# Altium schematic sheet 0021_Processor PD BOM -.SchDoc
size A3
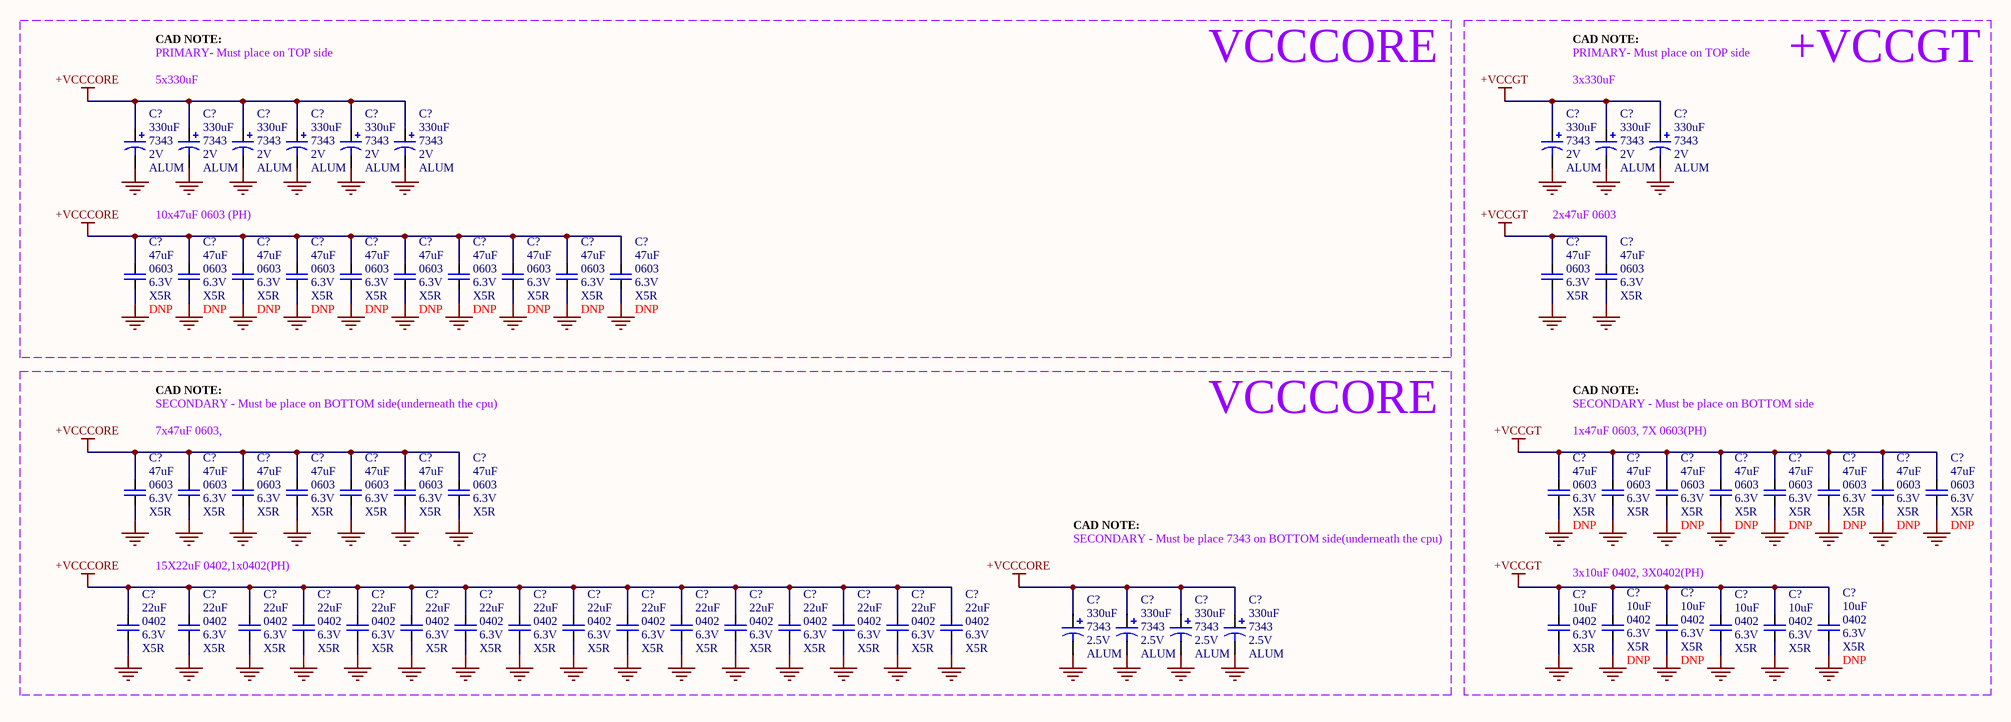
[diagram p0: 0021_Processor PD BOM -.SchDoc]

## Parts
(Parts that share a designator on the sheet are numbered #1, #2 ... from top to bottom, then left to right.)
C?#1  value 330uF  Case/Package: 7343  Voltage: 2V  Dielectric: ALUM  [CAPC_CASE-D2_7343_1.5]  (hidden comment: cap_polar)
C?#2  value 330uF  Case/Package: 7343  Voltage: 2V  Dielectric: ALUM  [CAPC_CASE-D2_7343_1.5]  (hidden comment: cap_polar)
C?#3  value 330uF  Case/Package: 7343  Voltage: 2V  Dielectric: ALUM  [CAPC_CASE-D2_7343_1.5]  (hidden comment: cap_polar)
C?#4  value 330uF  Case/Package: 7343  Voltage: 2V  Dielectric: ALUM  [CAPC_CASE-D2_7343_1.5]  (hidden comment: cap_polar)
C?#5  value 330uF  Case/Package: 7343  Voltage: 2V  Dielectric: ALUM  [CAPC_CASE-D2_7343_1.5]  (hidden comment: cap_polar)
C?#6  value 330uF  Case/Package: 7343  Voltage: 2V  Dielectric: ALUM  [CAPC_CASE-D2_7343_1.5]  (hidden comment: cap_polar)
C?#7  value 330uF  Case/Package: 7343  Voltage: 2V  Dielectric: ALUM  [CAPC_CASE-D2_7343_1.5]  (hidden comment: cap_polar)
C?#8  value 330uF  Case/Package: 7343  Voltage: 2V  Dielectric: ALUM  [CAPC_CASE-D2_7343_1.5]  (hidden comment: cap_polar)
C?#9  value 330uF  Case/Package: 7343  Voltage: 2V  Dielectric: ALUM  [CAPC_CASE-D2_7343_1.5]  (hidden comment: cap_polar)
C?#10  value 47uF  Case/Package: 0603  Voltage: 6.3V  Dielectric: X5R  [capc0603]
C?#11  value 47uF  Case/Package: 0603  Voltage: 6.3V  Dielectric: X5R  [capc0603]
C?#12  value 47uF  Case/Package: 0603  Voltage: 6.3V  Dielectric: X5R  [capc0603]
C?#13  value 47uF  Case/Package: 0603  Voltage: 6.3V  Dielectric: X5R  [capc0603]
C?#14  value 47uF  Case/Package: 0603  Voltage: 6.3V  Dielectric: X5R  [capc0603]
C?#15  value 47uF  Case/Package: 0603  Voltage: 6.3V  Dielectric: X5R  [capc0603]
C?#16  value 47uF  Case/Package: 0603  Voltage: 6.3V  Dielectric: X5R  [capc0603]
C?#17  value 47uF  Case/Package: 0603  Voltage: 6.3V  Dielectric: X5R  [capc0603]
C?#18  value 47uF  Case/Package: 0603  Voltage: 6.3V  Dielectric: X5R  [capc0603]
C?#19  value 47uF  Case/Package: 0603  Voltage: 6.3V  Dielectric: X5R  [capc0603]
C?#20  value 47uF  Case/Package: 0603  Voltage: 6.3V  Dielectric: X5R  [capc0603]
C?#21  value 47uF  Case/Package: 0603  Voltage: 6.3V  Dielectric: X5R  [capc0603]
C?#22  value 47uF  Case/Package: 0603  Voltage: 6.3V  Dielectric: X5R  [capc0603]
C?#23  value 47uF  Case/Package: 0603  Voltage: 6.3V  Dielectric: X5R  [capc0603]
C?#24  value 47uF  Case/Package: 0603  Voltage: 6.3V  Dielectric: X5R  [capc0603]
C?#25  value 47uF  Case/Package: 0603  Voltage: 6.3V  Dielectric: X5R  [capc0603]
C?#26  value 47uF  Case/Package: 0603  Voltage: 6.3V  Dielectric: X5R  [capc0603]
C?#27  value 47uF  Case/Package: 0603  Voltage: 6.3V  Dielectric: X5R  [capc0603]
C?#28  value 47uF  Case/Package: 0603  Voltage: 6.3V  Dielectric: X5R  [capc0603]
C?#29  value 47uF  Case/Package: 0603  Voltage: 6.3V  Dielectric: X5R  [capc0603]
C?#30  value 47uF  Case/Package: 0603  Voltage: 6.3V  Dielectric: X5R  [capc0603]
C?#31  value 47uF  Case/Package: 0603  Voltage: 6.3V  Dielectric: X5R  [capc0603]
C?#32  value 47uF  Case/Package: 0603  Voltage: 6.3V  Dielectric: X5R  [capc0603]
C?#33  value 47uF  Case/Package: 0603  Voltage: 6.3V  Dielectric: X5R  [capc0603]
C?#34  value 47uF  Case/Package: 0603  Voltage: 6.3V  Dielectric: X5R  [capc0603]
C?#35  value 47uF  Case/Package: 0603  Voltage: 6.3V  Dielectric: X5R  [capc0603]
C?#36  value 47uF  Case/Package: 0603  Voltage: 6.3V  Dielectric: X5R  [capc0603]
C?#37  value 330uF  Case/Package: 7343  Voltage: 2.5V  Dielectric: ALUM  [CAPC_CASE-D2_7343_1.5]  (hidden comment: cap_polar)
C?#38  value 330uF  Case/Package: 7343  Voltage: 2.5V  Dielectric: ALUM  [CAPC_CASE-D2_7343_1.5]  (hidden comment: cap_polar)
C?#39  value 330uF  Case/Package: 7343  Voltage: 2.5V  Dielectric: ALUM  [CAPC_CASE-D2_7343_1.5]  (hidden comment: cap_polar)
C?#40  value 330uF  Case/Package: 7343  Voltage: 2.5V  Dielectric: ALUM  [CAPC_CASE-D2_7343_1.5]  (hidden comment: cap_polar)
C?#41  value 22uF  Case/Package: 0402  Voltage: 6.3V  Dielectric: X5R  [CAPC0402]
C?#42  value 22uF  Case/Package: 0402  Voltage: 6.3V  Dielectric: X5R  [CAPC0402]
C?#43  value 22uF  Case/Package: 0402  Voltage: 6.3V  Dielectric: X5R  [CAPC0402]
C?#44  value 22uF  Case/Package: 0402  Voltage: 6.3V  Dielectric: X5R  [CAPC0402]
C?#45  value 22uF  Case/Package: 0402  Voltage: 6.3V  Dielectric: X5R  [CAPC0402]
C?#46  value 22uF  Case/Package: 0402  Voltage: 6.3V  Dielectric: X5R  [CAPC0402]
C?#47  value 22uF  Case/Package: 0402  Voltage: 6.3V  Dielectric: X5R  [CAPC0402]
C?#48  value 22uF  Case/Package: 0402  Voltage: 6.3V  Dielectric: X5R  [CAPC0402]
C?#49  value 22uF  Case/Package: 0402  Voltage: 6.3V  Dielectric: X5R  [CAPC0402]
C?#50  value 22uF  Case/Package: 0402  Voltage: 6.3V  Dielectric: X5R  [CAPC0402]
C?#51  value 22uF  Case/Package: 0402  Voltage: 6.3V  Dielectric: X5R  [CAPC0402]
C?#52  value 22uF  Case/Package: 0402  Voltage: 6.3V  Dielectric: X5R  [CAPC0402]
C?#53  value 22uF  Case/Package: 0402  Voltage: 6.3V  Dielectric: X5R  [CAPC0402]
C?#54  value 22uF  Case/Package: 0402  Voltage: 6.3V  Dielectric: X5R  [CAPC0402]
C?#55  value 22uF  Case/Package: 0402  Voltage: 6.3V  Dielectric: X5R  [CAPC0402]
C?#56  value 22uF  Case/Package: 0402  Voltage: 6.3V  Dielectric: X5R  [CAPC0402]
C?#57  value 10uF  Case/Package: 0402  Voltage: 6.3V  Dielectric: X5R  [CAPC0402]
C?#58  value 10uF  Case/Package: 0402  Voltage: 6.3V  Dielectric: X5R  [CAPC0402]
C?#59  value 10uF  Case/Package: 0402  Voltage: 6.3V  Dielectric: X5R  [CAPC0402]
C?#60  value 10uF  Case/Package: 0402  Voltage: 6.3V  Dielectric: X5R  [CAPC0402]
C?#61  value 10uF  Case/Package: 0402  Voltage: 6.3V  Dielectric: X5R  [CAPC0402]
C?#62  value 10uF  Case/Package: 0402  Voltage: 6.3V  Dielectric: X5R  [CAPC0402]

## Nets
+VCCCORE: C?#1.1(+) C?#2.1(+) C?#3.1(+) C?#4.1(+) C?#5.1(+) C?#6.1(+) C?#10.1 C?#11.1 C?#12.1 C?#13.1 C?#14.1 C?#15.1 C?#16.1 C?#17.1 C?#18.1 C?#19.1 C?#22.1 C?#23.1 C?#24.1 C?#25.1 C?#26.1 C?#27.1 C?#28.1 C?#37.1(+) C?#38.1(+) C?#39.1(+) C?#40.1(+) C?#41.1 C?#42.1 C?#43.1 C?#44.1 C?#45.1 C?#46.1 C?#47.1 C?#48.1 C?#49.1 C?#50.1 C?#51.1 C?#52.1 C?#53.1 C?#54.1 C?#55.1 C?#56.1
+VCCGT: C?#7.1(+) C?#8.1(+) C?#9.1(+) C?#20.1 C?#21.1 C?#29.1 C?#30.1 C?#31.1 C?#32.1 C?#33.1 C?#34.1 C?#35.1 C?#36.1 C?#57.1 C?#58.1 C?#59.1 C?#60.1 C?#61.1 C?#62.1
GND: C?#1.2 C?#2.2 C?#3.2 C?#4.2 C?#5.2 C?#6.2 C?#7.2 C?#8.2 C?#9.2 C?#10.2 C?#11.2 C?#12.2 C?#13.2 C?#14.2 C?#15.2 C?#16.2 C?#17.2 C?#18.2 C?#19.2 C?#20.2 C?#21.2 C?#22.2 C?#23.2 C?#24.2 C?#25.2 C?#26.2 C?#27.2 C?#28.2 C?#29.2 C?#30.2 C?#31.2 C?#32.2 C?#33.2 C?#34.2 C?#35.2 C?#36.2 C?#37.2 C?#38.2 C?#39.2 C?#40.2 C?#41.2 C?#42.2 C?#43.2 C?#44.2 C?#45.2 C?#46.2 C?#47.2 C?#48.2 C?#49.2 C?#50.2 C?#51.2 C?#52.2 C?#53.2 C?#54.2 C?#55.2 C?#56.2 C?#57.2 C?#58.2 C?#59.2 C?#60.2 C?#61.2 C?#62.2

## Notes on the sheet
- CAD NOTE:
- PRIMARY- Must place on TOP side
- 5x330uF
- VCCCORE
- 3x330uF
- +VCCGT
- (near C?#11) 10x47uF 0603 (PH)
- (near C?#20) 2x47uF 0603
- SECONDARY - Must be place on BOTTOM side(underneath the cpu)
- (near C?#23) 7x47uF 0603,
- (near C?#31) 1x47uF 0603, 7X 0603(PH)
- SECONDARY - Must be place on BOTTOM side
- (near C?#42) 15X22uF 0402,1x0402(PH)
- SECONDARY - Must be place 7343 on BOTTOM side(underneath the cpu)
- (near C?#58) 3x10uF 0402, 3X0402(PH)

## Library data of the parts
C?#1-C?#9 = cap_polar: CAP ALUM POLY 330UF 2V 7343; Manufacturer Part Number: EEF-ST0D331R; Type: Polymer
C?#10-C?#36 = Cap: CAP CER 47uF 6.3V X5R 0603
  C?#10-C?#19 C?#29 C?#31-C?#36: DNP: DNP
C?#37-C?#40 = cap_polar: CAP ALUM POLY 330UF 2.5V 7343; Manufacturer Part Number: EEF-ST0D331R; Type: Polymer
C?#41-C?#62 = Cap: CAP CER 10uF 6.3V X5R 0402
  C?#58 C?#59 C?#62: DNP: DNP